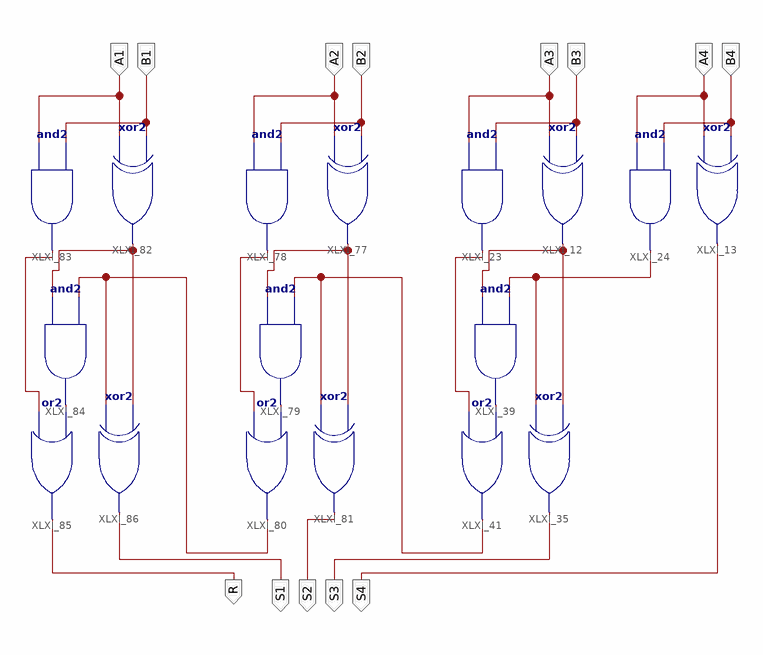
[diagram p0: schematic sheet 1]
// Xilinx ISE schematic adder.sch (spartan3e) as structural Verilog: 17 symbols, 13 ports
module adder (
  input  B4,
  input  A4,
  input  A3,
  input  B3,
  input  A2,
  input  B2,
  input  A1,
  input  B1,
  output S4,
  output R,
  output S1,
  output S2,
  output S3
);

  wire XLXN_59, XLXN_63, XLXN_66, XLXN_67, XLXN_145, XLXN_146, XLXN_147, XLXN_148, XLXN_157, XLXN_158,
       XLXN_159, XLXN_160;

  xor XLXI_13 (S4, A4, B4);
  xor XLXI_12 (XLXN_63, A3, B3);
  and XLXI_24 (XLXN_59, A4, B4);
  and XLXI_23 (XLXN_67, A3, B3);
  and XLXI_39 (XLXN_66, XLXN_63, XLXN_59);
  or XLXI_41 (XLXN_148, XLXN_67, XLXN_66);
  xor XLXI_35 (S3, XLXN_59, XLXN_63);
  xor XLXI_77 (XLXN_145, A2, B2);
  and XLXI_78 (XLXN_147, A2, B2);
  and XLXI_79 (XLXN_146, XLXN_145, XLXN_148);
  or XLXI_80 (XLXN_160, XLXN_147, XLXN_146);
  xor XLXI_81 (S2, XLXN_148, XLXN_145);
  xor XLXI_82 (XLXN_157, A1, B1);
  and XLXI_83 (XLXN_159, A1, B1);
  and XLXI_84 (XLXN_158, XLXN_157, XLXN_160);
  or XLXI_85 (R, XLXN_159, XLXN_158);
  xor XLXI_86 (S1, XLXN_160, XLXN_157);
endmodule
